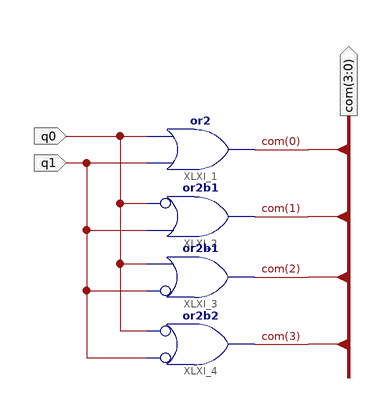
[diagram p0: schematic sheet 1]
// Xilinx ISE schematic Decoder.sch (spartan6) as structural Verilog: 4 symbols, 3 ports
module Decoder (
  input  q1,
  input  q0,
  output [3:0] com
);

  or XLXI_1 (com[0], q0, q1);
  or XLXI_2 (com[1], ~q0, q1);  // or2b1
  or XLXI_3 (com[2], ~q1, q0);  // or2b1
  or XLXI_4 (com[3], ~q1, ~q0);  // or2b2
endmodule
